# EAGLE design Shruthi-612-v01 (EAGLE 5.09)

## Sheet 1 of 4
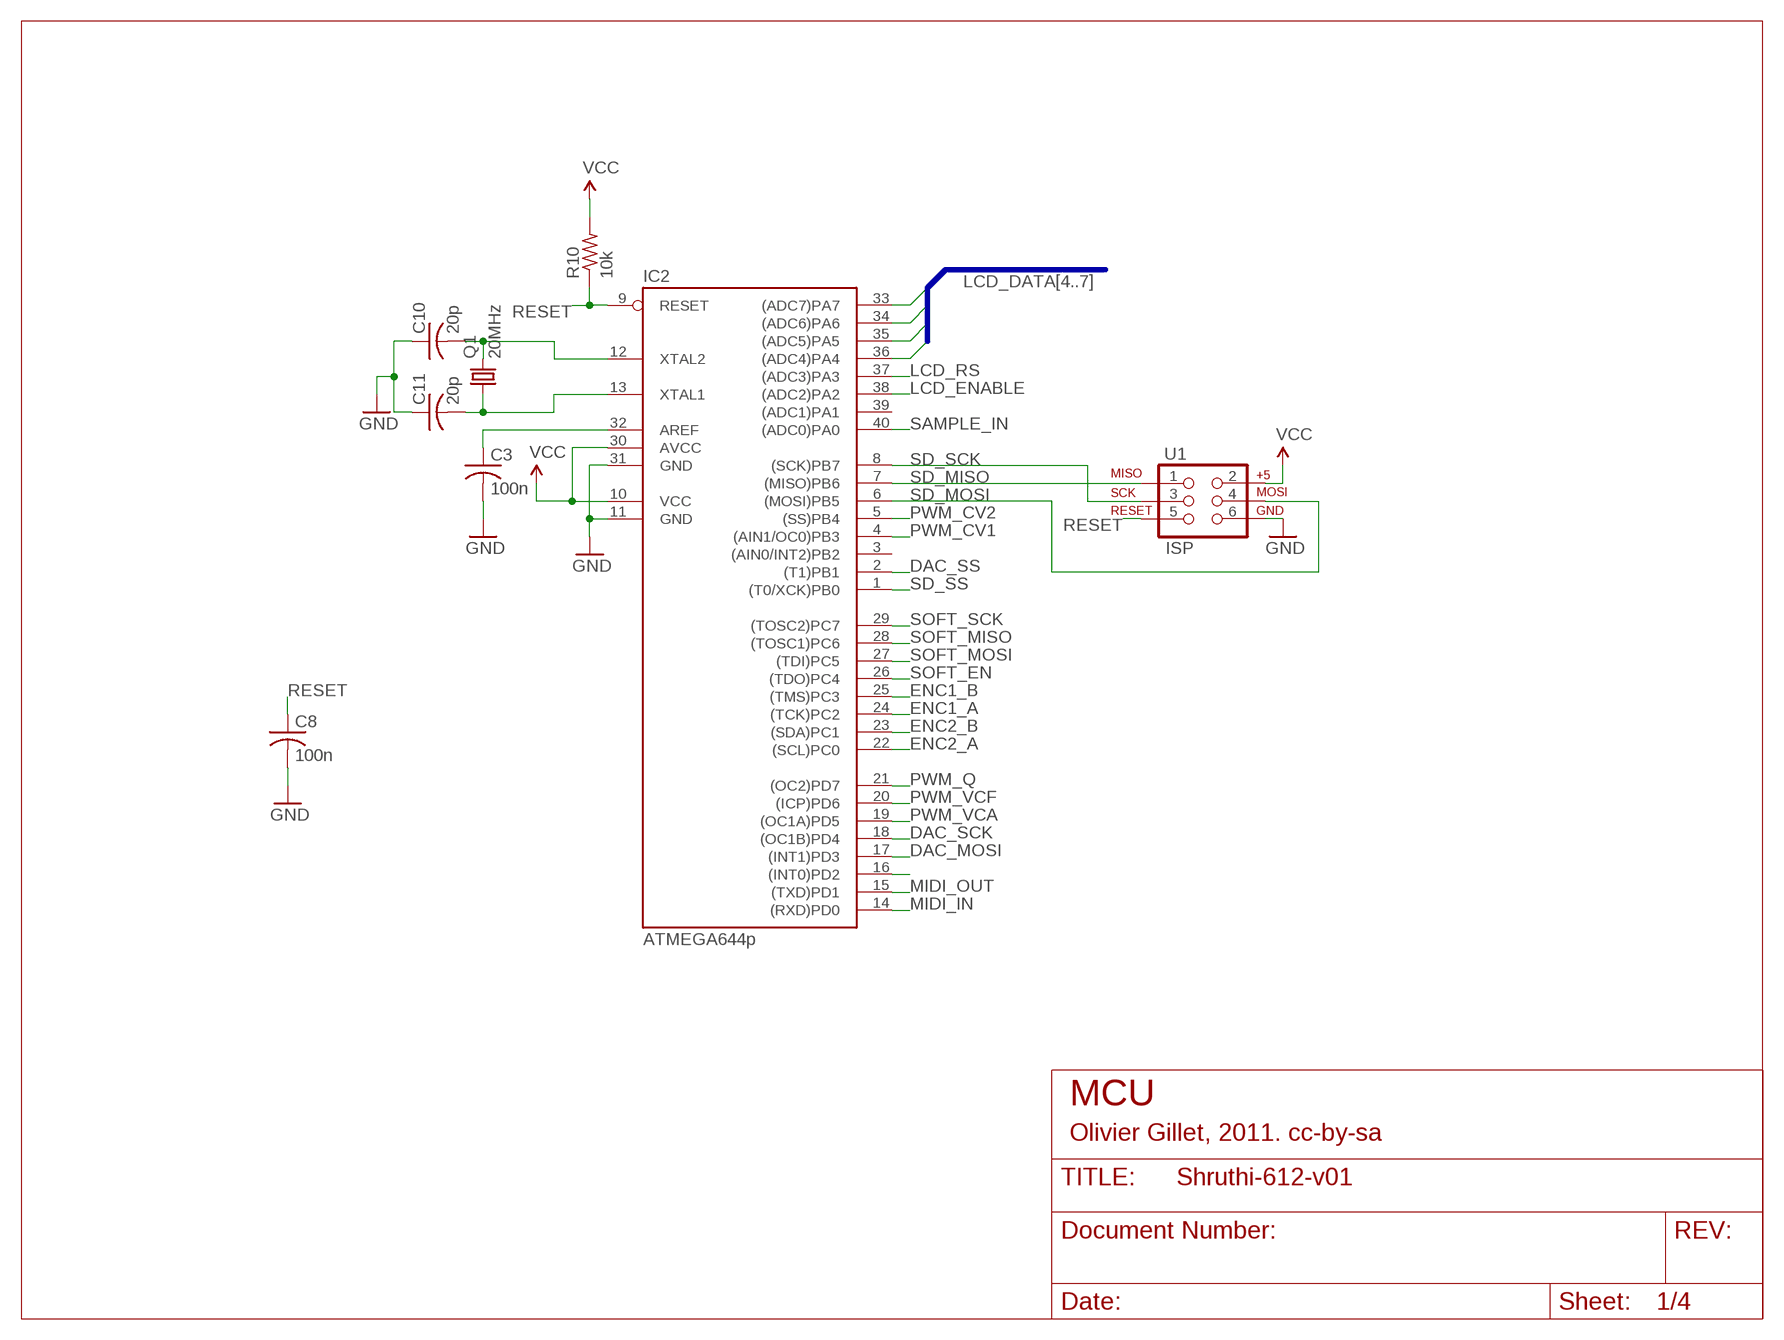
[diagram p0: schematic, sheet 1]

### Parts
C3  100n  C-US025-024X044  [C025-024X044]
C8  100n  C-US025-024X044  [C025-024X044]
C10  20p  C-US025-024X044  [C025-024X044]
C11  20p  C-US025-024X044  [C025-024X044]
IC2  ATMEGA644p  MEGA16-P  [DIL40]
Q1  20MHz  CRYSTALHC49U-V  [HC49U-V]
R10  10k  R-US_0204/7  [0204/7]
U1  ISP  AVR_SPI_PRG_6PTH  [2X3]

### Nets
DAC_MOSI: IC2.17((INT1)PD3) ; also sheet 3
DAC_SCK: IC2.18((OC1B)PD4) ; also sheet 3
DAC_SS: IC2.2((T1)PB1) ; also sheet 3
ENC1_A: IC2.24((TCK)PC2) ; also sheet 2
ENC1_B: IC2.25((TMS)PC3) ; also sheet 2
ENC2_A: IC2.22((SCL)PC0) ; also sheet 2
ENC2_B: IC2.23((SDA)PC1) ; also sheet 2
GND: C3.2 C8.2 C10.1 C11.1 IC2.11(GND) IC2.31(GND) U1.6 ; also sheet 2,3,4
LCD_DATA4: IC2.36((ADC4)PA4) ; also sheet 2
LCD_DATA5: IC2.35((ADC5)PA5) ; also sheet 2
LCD_DATA6: IC2.34((ADC6)PA6) ; also sheet 2
LCD_DATA7: IC2.33((ADC7)PA7) ; also sheet 2
LCD_ENABLE: IC2.38((ADC2)PA2) ; also sheet 2
LCD_RS: IC2.37((ADC3)PA3) ; also sheet 2
MIDI_IN: IC2.14((RXD)PD0) ; also sheet 3
MIDI_OUT: IC2.15((TXD)PD1) ; also sheet 3
N$7: C3.1 IC2.32(AREF)
N$14: IC2.16((INT0)PD2)
N$82: C11.2 IC2.13(XTAL1) Q1.1
N$83: C10.2 IC2.12(XTAL2) Q1.2
PWM_CV1: IC2.4((AIN1/OC0)PB3) ; also sheet 3
PWM_CV2: IC2.5((SS)PB4) ; also sheet 3
PWM_Q: IC2.21((OC2)PD7) ; also sheet 3
PWM_VCA: IC2.19((OC1A)PD5) ; also sheet 3
PWM_VCF: IC2.20((ICP)PD6) ; also sheet 3
RESET: C8.1 IC2.9(RESET) R10.1 U1.5
SAMPLE_IN: IC2.40((ADC0)PA0) ; also sheet 3
SD_MISO: IC2.7((MISO)PB6) U1.1 ; also sheet 3
SD_MOSI: IC2.6((MOSI)PB5) U1.4 ; also sheet 3
SD_SCK: IC2.8((SCK)PB7) U1.3 ; also sheet 3
SD_SS: IC2.1((T0/XCK)PB0) ; also sheet 3
SOFT_EN: IC2.26((TDO)PC4) ; also sheet 2
SOFT_MISO: IC2.28((TOSC1)PC6) ; also sheet 2
SOFT_MOSI: IC2.27((TDI)PC5) ; also sheet 2
SOFT_SCK: IC2.29((TOSC2)PC7) ; also sheet 2
VCC: IC2.10(VCC) IC2.30(AVCC) R10.2 U1.2 ; also sheet 2,3,4
Unconnected: IC2.3((AIN0/INT2)PB2) IC2.39((ADC1)PA1)

### Buses
LCD_DATA[4..7]

### Notes on the sheet
- MCU
- Olivier Gillet, 2011. cc-by-sa

## Sheet 2 of 4
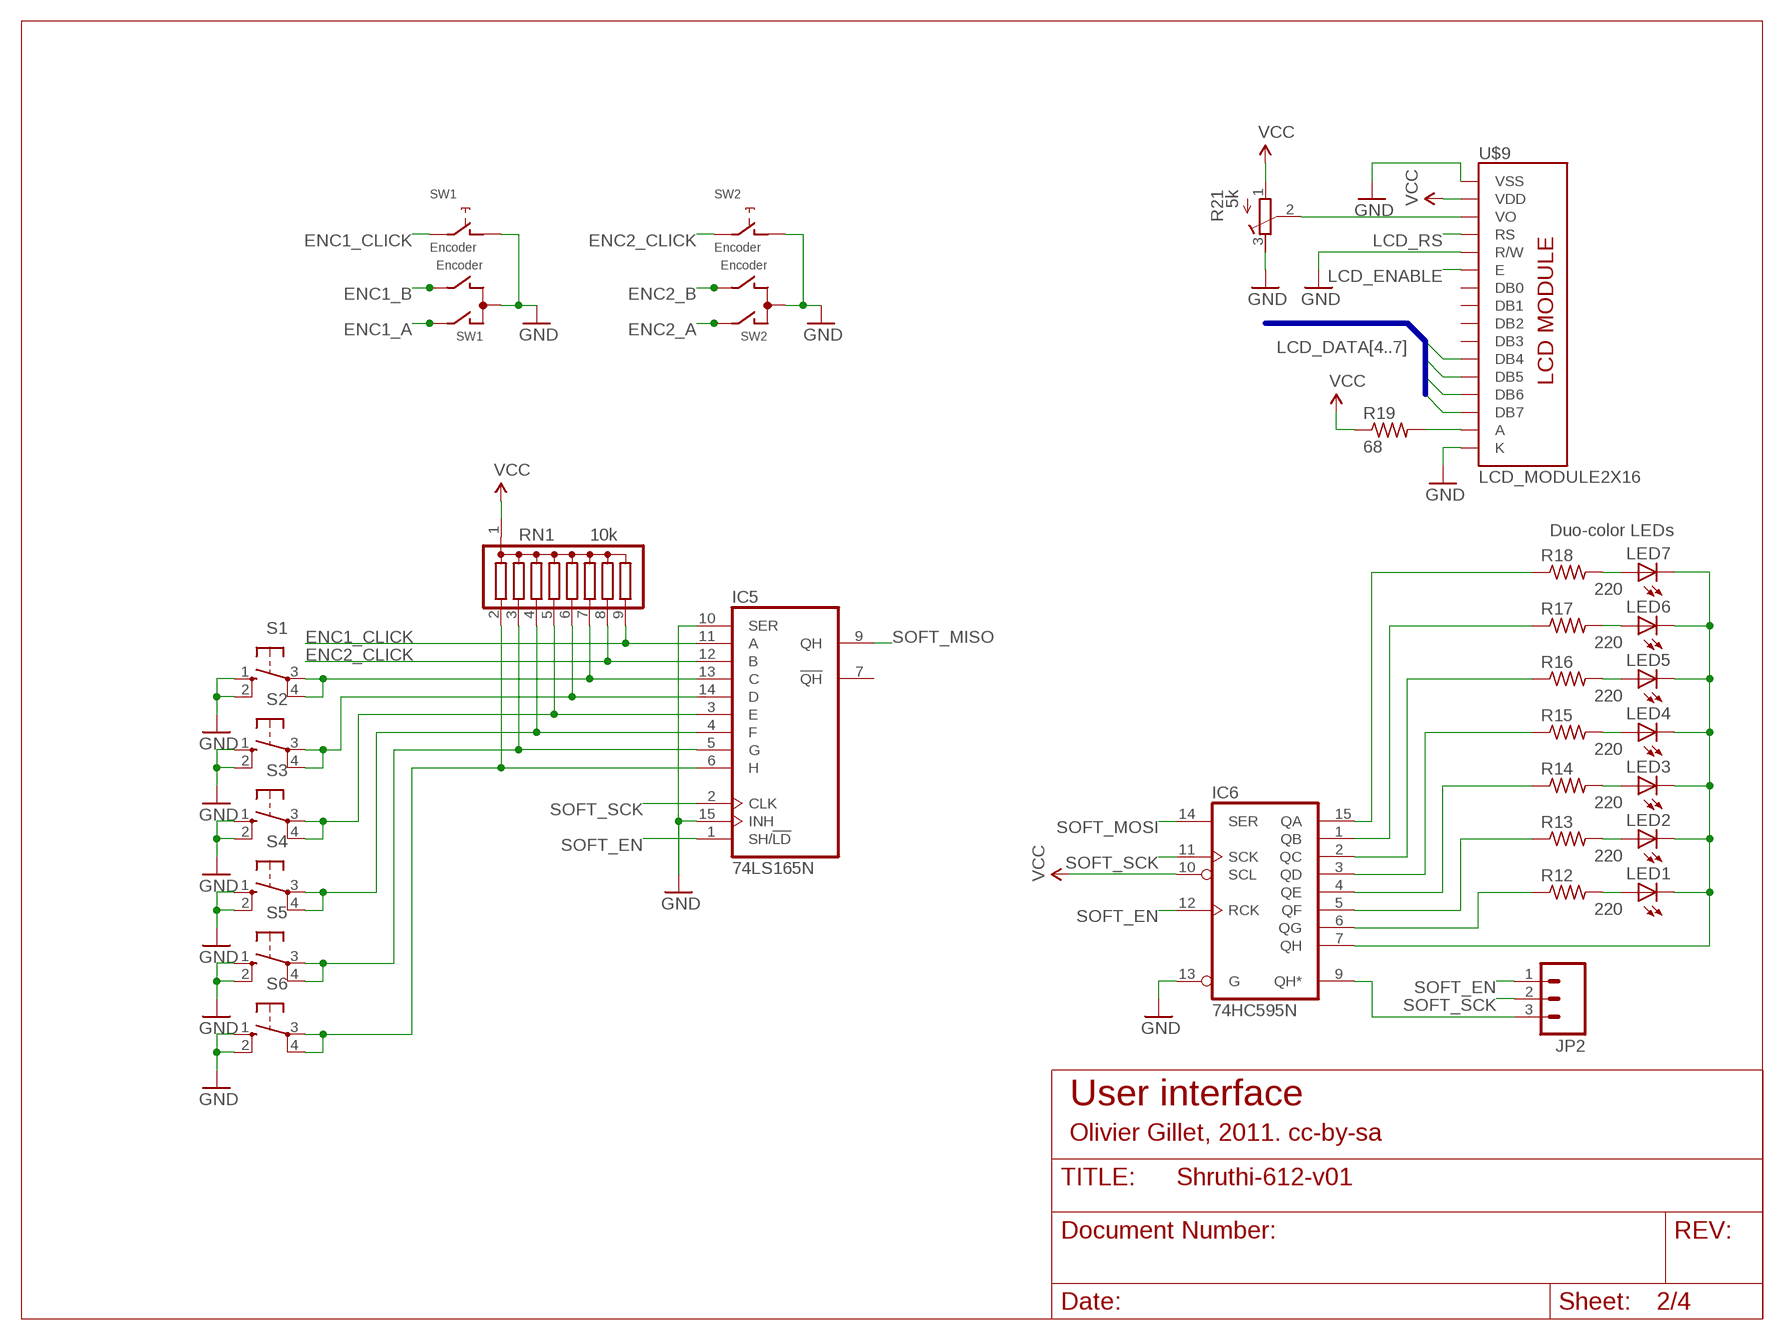
[diagram p1: schematic, sheet 2]

### Parts
IC5  74LS165N  [DIL16]
IC6  74HC595N  [DIL16]
JP2  M03PTH  [1X03]
LED1  LED3MM  [LED3MM]
LED2  LED3MM  [LED3MM]
LED3  LED3MM  [LED3MM]
LED4  LED3MM  [LED3MM]
LED5  LED3MM  [LED3MM]
LED6  LED3MM  [LED3MM]
LED7  LED3MM  [LED3MM]
R12  220  R-US_0204/7  [0204/7]
R13  220  R-US_0204/7  [0204/7]
R14  220  R-US_0204/7  [0204/7]
R15  220  R-US_0204/7  [0204/7]
R16  220  R-US_0204/7  [0204/7]
R17  220  R-US_0204/7  [0204/7]
R18  220  R-US_0204/7  [0204/7]
R19  68  R-US_0204/7  [0204/7]
R21  5k  R-TRIMM3296P  [RTRIM3296P]
RN1  10k  G08R  [SIL9]
S1  40-XX  [B3F-40XX]
S2  40-XX  [B3F-40XX]
S3  40-XX  [B3F-40XX]
S4  40-XX  [B3F-40XX]
S5  40-XX  [B3F-40XX]
S6  40-XX  [B3F-40XX]
SW1  Encoder  EC12E_SW  [ALPS_EC12E_SW]
SW2  Encoder  EC12E_SW  [ALPS_EC12E_SW]
U$9  LCD_MODULE2X16  [LCD_MODULE_2X16]

### Nets
ENC1_A: SW1.A ; also sheet 1
ENC1_B: SW1.B ; also sheet 1
ENC1_CLICK: IC5.11(A) RN1.9 SW1.E
ENC2_A: SW2.A ; also sheet 1
ENC2_B: SW2.B ; also sheet 1
ENC2_CLICK: IC5.12(B) RN1.8 SW2.E
GND: IC5.10(SER) IC5.15(INH) IC6.13(G) R21.3(A) S1.1(S) S1.2(S1) S2.1(S) S2.2(S1) S3.1(S) S3.2(S1) S4.1(S) S4.2(S1) S5.1(S) S5.2(S1) S6.1(S) S6.2(S1) SW1.C SW1.D SW2.C SW2.D U$9.1(VSS) U$9.5(R/W) U$9.16(K) ; also sheet 1,3,4
LCD_DATA4: U$9.11(DB4) ; also sheet 1
LCD_DATA5: U$9.12(DB5) ; also sheet 1
LCD_DATA6: U$9.13(DB6) ; also sheet 1
LCD_DATA7: U$9.14(DB7) ; also sheet 1
LCD_ENABLE: U$9.6(E) ; also sheet 1
LCD_RS: U$9.4(RS) ; also sheet 1
N$1: IC6.2(QC) R16.1
N$2: IC5.5(G) RN1.3 S5.3(P) S5.4(P1)
N$3: IC6.9(QH*) JP2.3
N$6: IC5.13(C) RN1.7 S1.3(P) S1.4(P1)
N$10: IC5.6(H) RN1.2 S6.3(P) S6.4(P1)
N$12: IC5.4(F) RN1.4 S4.3(P) S4.4(P1)
N$16: IC5.14(D) RN1.6 S2.3(P) S2.4(P1)
N$18: R21.2(S) U$9.3(VO)
N$30: IC6.15(QA) R18.1
N$31: IC6.1(QB) R17.1
N$33: IC6.3(QD) R15.1
N$34: IC6.4(QE) R14.1
N$35: IC6.5(QF) R13.1
N$36: IC6.7(QH) LED1.K(C) LED2.K(C) LED3.K(C) LED4.K(C) LED5.K(C) LED6.K(C) LED7.K(C)
N$37: IC6.6(QG) R12.1
N$42: LED7.A R18.2
N$43: LED6.A R17.2
N$44: LED5.A R16.2
N$45: LED4.A R15.2
N$46: LED3.A R14.2
N$47: LED2.A R13.2
N$48: LED1.A R12.2
N$79: R19.2 U$9.15(A)
N$90: IC5.3(E) RN1.5 S3.3(P) S3.4(P1)
SOFT_EN: IC5.1(SH/!LD) IC6.12(RCK) JP2.1 ; also sheet 1
SOFT_MISO: IC5.9(QH) ; also sheet 1
SOFT_MOSI: IC6.14(SER) ; also sheet 1
SOFT_SCK: IC5.2(CLK) IC6.11(SCK) JP2.2 ; also sheet 1
VCC: IC6.10(SCL) R19.1 R21.1(E) RN1.1 U$9.2(VDD) ; also sheet 1,3,4
Unconnected: IC5.7(!QH) SW1.GND1(G) SW1.GND2(G) SW2.GND1(G) SW2.GND2(G) U$9.7(DB0) U$9.8(DB1) U$9.9(DB2) U$9.10(DB3)

### Buses
LCD_DATA[4..7]

### Notes on the sheet
- Duo-color LEDs
- User interface
- Olivier Gillet, 2011. cc-by-sa

## Sheet 3 of 4
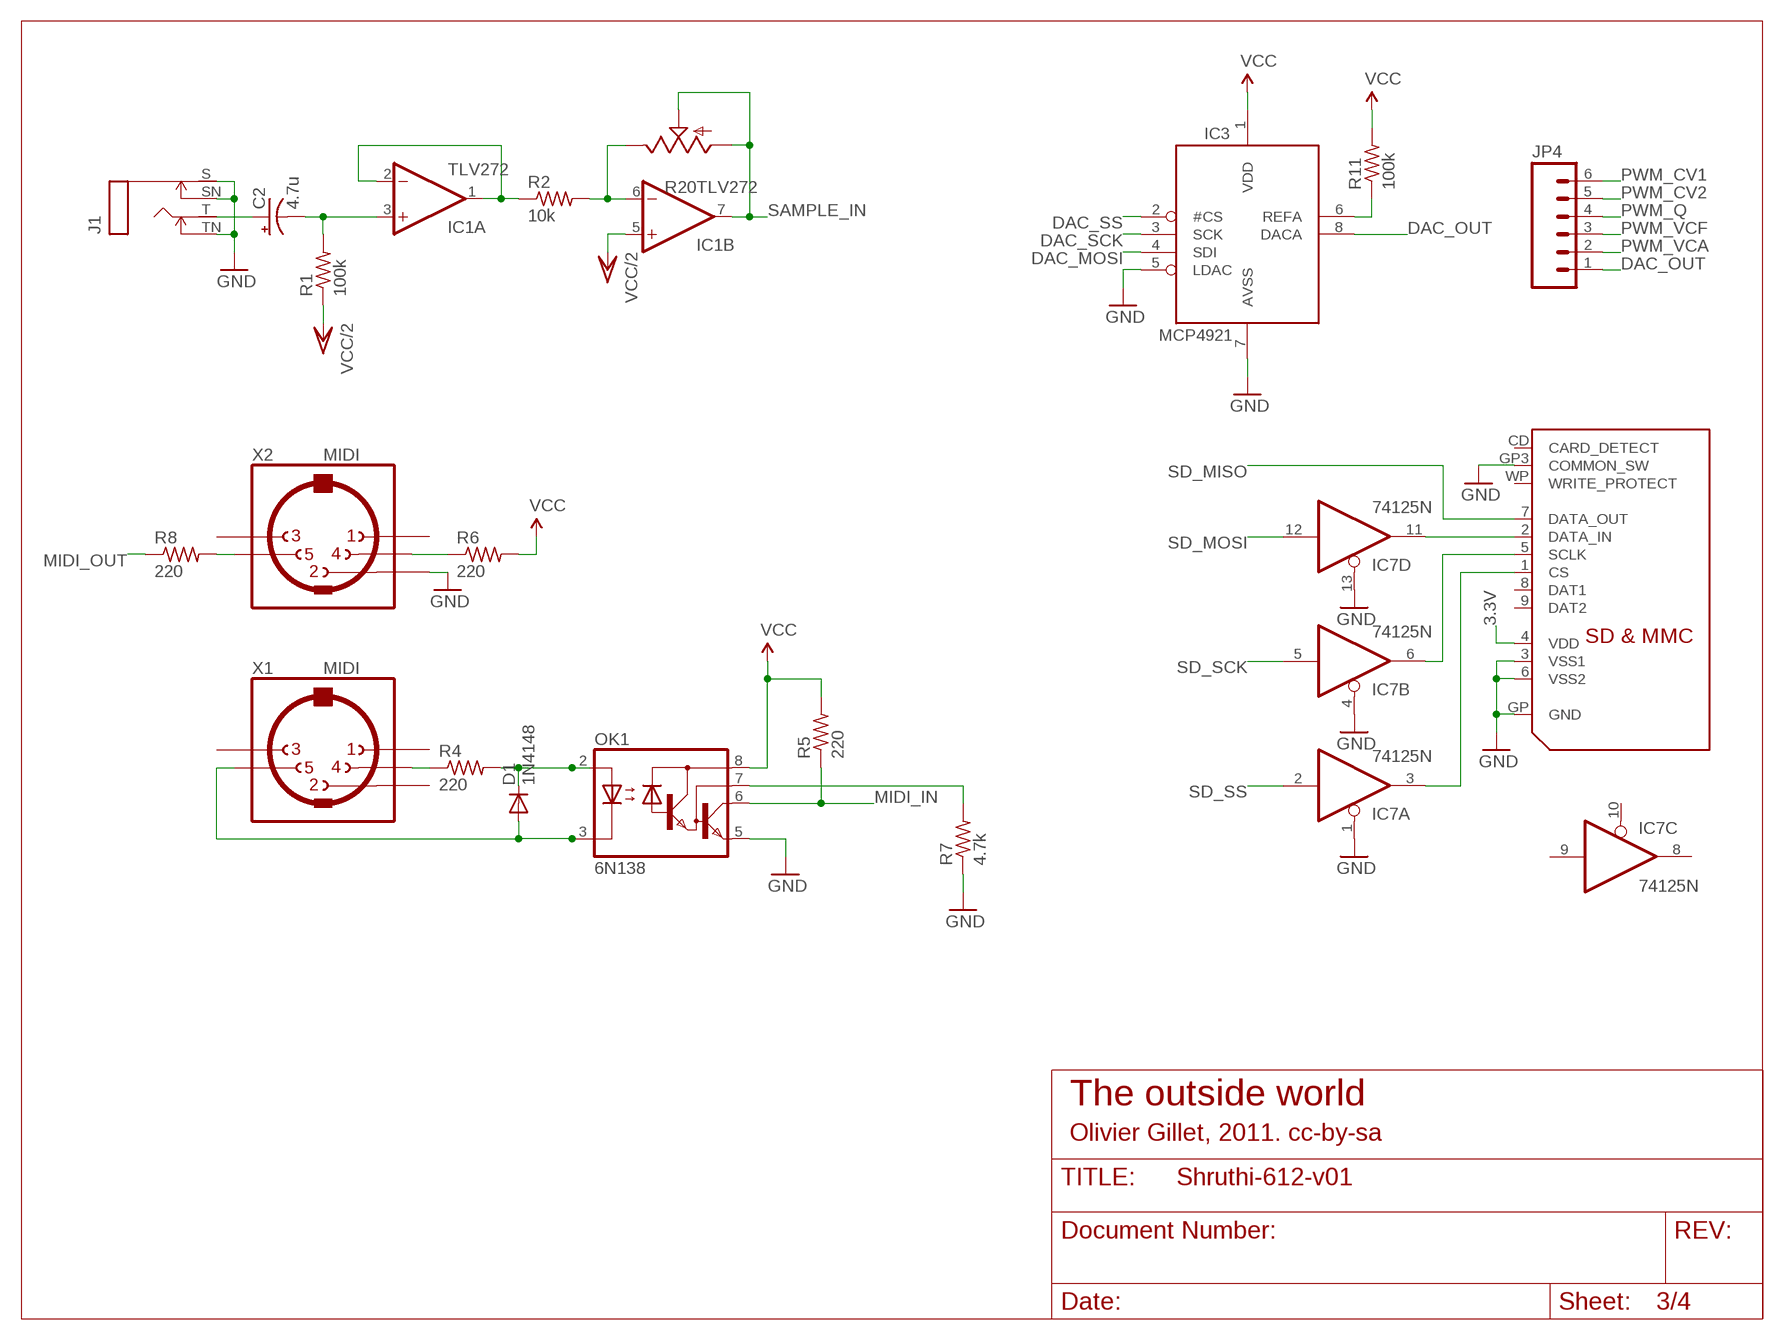
[diagram p2: schematic, sheet 3]

### Parts
C2  4.7u  CPOL-USE2.5-7  [E2,5-7]
D1  1N4148  DIODE-D-5  [D-5]
IC1  TLV272  TL072P  [DIL08]
IC3  MCP4921  [DIL08]
IC7  74125N  [DIL14]
J1  MONOSWS  [NMJ4HC-S]
JP4  M06SIP  [1X06]
OK1  6N138  [DIL08]
R1  100k  R-US_0204/7  [0204/7]
R2  10k  R-US_0204/7  [0204/7]
R4  220  R-US_0204/7  [0204/7]
R5  220  R-US_0204/7  [0204/7]
R6  220  R-US_0204/7  [0204/7]
R7  4.7k  R-US_0204/7  [0204/7]
R8  220  R-US_0204/7  [0204/7]
R11  100k  R-US_0204/7  [0204/7]
R20  POT_USVERTICAL  [ALPS_POT_VERTICAL]
U$8  SDMMC06132  [06132]
X1  MIDI  MAB5SH  [MAB5SH]
X2  MIDI  MAB5SH  [MAB5SH]

### Nets
3.3V: U$8.4(VDD) ; also sheet 4
AVSS: IC3.7(AVSS) ; supply symbol labelled GND
DAC_MOSI: IC3.4(SDI) ; also sheet 1
DAC_OUT: IC3.8(DACA) JP4.1
DAC_SCK: IC3.3(SCK) ; also sheet 1
DAC_SS: IC3.2(#CS) ; also sheet 1
GND: IC3.5(LDAC) IC7.1(A:OE) IC7.4(B:OE) IC7.13(D:OE) J1.S J1.SN J1.TN OK1.5(GND) R7.1 U$8.3(VSS1) U$8.6(VSS2) U$8.GP3(COMMON_SW) U$8.GP(GND) X2.2 ; also sheet 1,2,4
MIDI_IN: OK1.6(VO) R5.1 ; also sheet 1
MIDI_OUT: R8.1 ; also sheet 1
N$4: IC1.1(A:OUT) IC1.2(A:-IN) R2.1
N$5: C2.- IC1.3(A:+IN) R1.2
N$8: R8.2 X2.5
N$11: IC3.6(REFA) R11.1
N$13: OK1.7(VB) R7.2
N$15: C2.+ J1.T
N$17: IC1.6(B:-IN) R2.2 R20.P$1(E)
N$25: IC7.11(D:O) U$8.2(DATA_IN)
N$28: D1.C OK1.2(A) R4.2
N$29: IC7.6(B:O) U$8.5(SCLK)
N$52: IC7.3(A:O) U$8.1(CS)
N$68: R6.1 X2.4
N$72: R4.1 X1.4
N$73: D1.A OK1.3(C) X1.5
PWM_CV1: JP4.6 ; also sheet 1
PWM_CV2: JP4.5 ; also sheet 1
PWM_Q: JP4.4 ; also sheet 1
PWM_VCA: JP4.2 ; also sheet 1
PWM_VCF: JP4.3 ; also sheet 1
SAMPLE_IN: IC1.7(B:OUT) R20.P$2(S) R20.P$3(A) ; also sheet 1
SD_MISO: U$8.7(DATA_OUT) ; also sheet 1
SD_MOSI: IC7.12(D:I) ; also sheet 1
SD_SCK: IC7.5(B:I) ; also sheet 1
SD_SS: IC7.2(A:I) ; also sheet 1
VCC: IC3.1(VDD) OK1.8(VCC) R5.2 R6.2 R11.2 ; also sheet 1,2,4
VCC/2: IC1.5(B:+IN) R1.1 ; also sheet 4
Unconnected: IC7.8(C:O) IC7.9(C:I) IC7.10(C:OE) U$8.8(DAT1) U$8.9(DAT2) U$8.CD(CARD_DETECT) U$8.WP(WRITE_PROTECT) X1.1 X1.2 X1.3 X2.1 X2.3

### Notes on the sheet
- The outside world
- Olivier Gillet, 2011. cc-by-sa

## Sheet 4 of 4
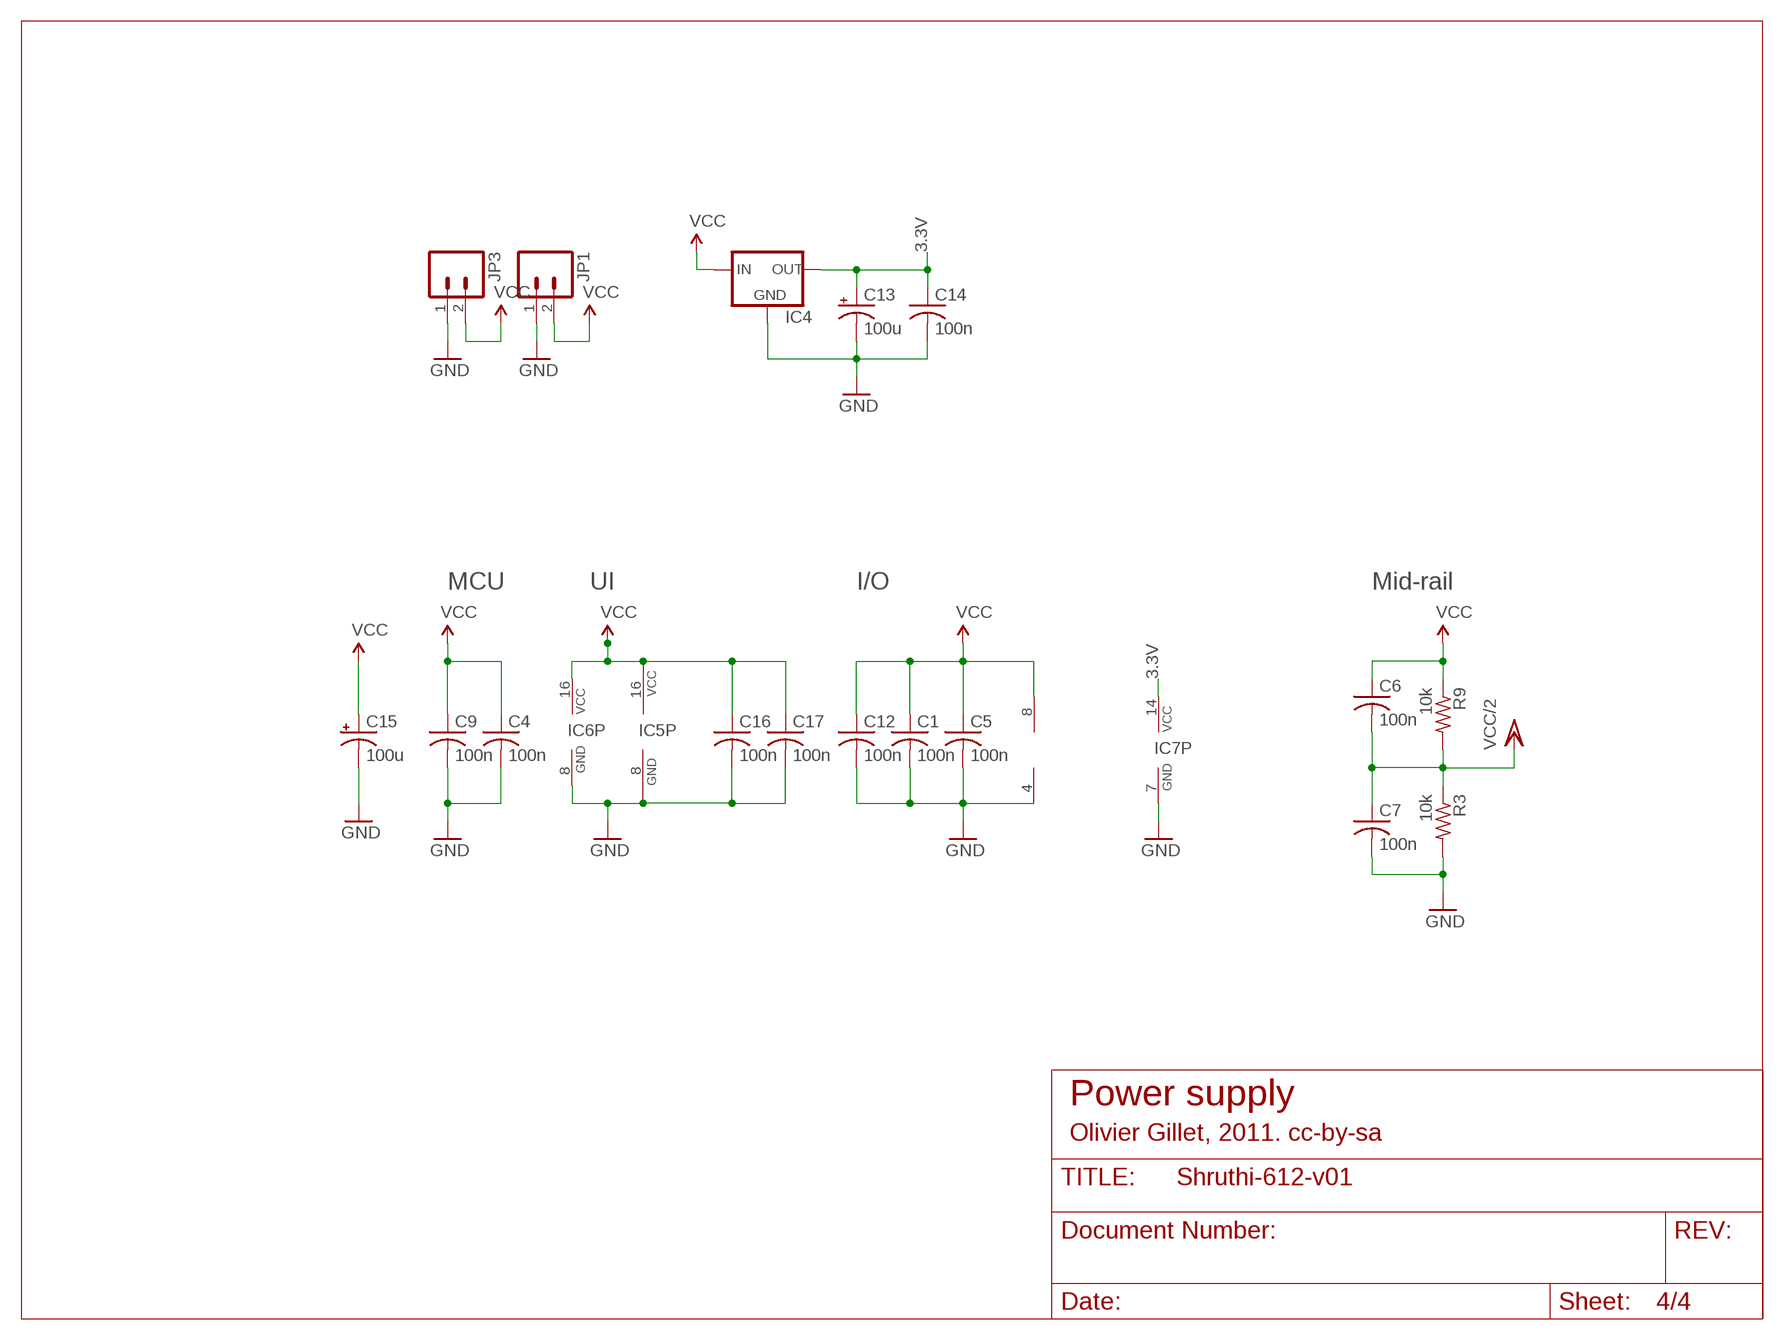
[diagram p3: schematic, sheet 4]

### Parts
C1  100n  C-US025-024X044  [C025-024X044]
C4  100n  C-US025-024X044  [C025-024X044]
C5  100n  C-US025-024X044  [C025-024X044]
C6  100n  C-US025-024X044  [C025-024X044]
C7  100n  C-US025-024X044  [C025-024X044]
C9  100n  C-US025-024X044  [C025-024X044]
C12  100n  C-US025-024X044  [C025-024X044]
C13  100u  CPOL-USE2.5-7  [E2,5-7]
C14  100n  C-US025-024X044  [C025-024X044]
C15  100u  CPOL-USE2.5-7  [E2,5-7]
C16  100n  C-US025-024X044  [C025-024X044]
C17  100n  C-US025-024X044  [C025-024X044]
IC4  MCP1700INLINE  [TO92-INLINE]
JP1  M02PTH  [1X02]
JP3  M02PTH  [1X02]
R3  10k  R-US_0204/7  [0204/7]
R9  10k  R-US_0204/7  [0204/7]

### Nets
3.3V: C13.+ C14.1 IC4.3(OUT) IC7.14(P:VCC) ; also sheet 3
GND: C1.2 C4.2 C5.2 C7.2 C9.2 C12.2 C13.- C14.2 C15.- C16.2 C17.2 IC1.4(P:V-) IC4.1(GND) IC5.8(GND) IC6.8(GND) IC7.7(P:GND) JP1.1 JP3.1 R3.2 ; also sheet 1,2,3
VCC: C1.1 C4.1 C5.1 C6.1 C9.1 C12.1 C15.+ C16.1 C17.1 IC1.8(P:V+) IC4.2(IN) IC5.16(VCC) IC6.16(VCC) JP1.2 JP3.2 R9.1 ; also sheet 1,2,3
VCC/2: C6.2 C7.1 R3.1 R9.2 ; also sheet 3

### Notes on the sheet
- MCU | UI | I/O | Mid-rail
- Power supply
- Olivier Gillet, 2011. cc-by-sa

## Library data of the parts
C1 C3-C12 C14 C16 C17 = rcl:C-US: CAPACITOR, American symbol
C2 C13 C15 = rcl:CPOL-US: POLARIZED CAPACITOR, American symbol
D1 = diode:DIODE-: DIODE
IC1 = gm-ics:TL072: OP AMP
IC2 = atmel:MEGA16-P: MICROCONTROLLER 16 Kbytes FLASH 1 kbytes SRAM 512 bytes EEPROM USART 8-channel 10 bit ADC Source: avr.lbr
IC3 = adafruit:MCP4921
IC4 = adafruit:MCP1700: VOLTAGE REGULATOR
IC5 = 74xx-us:74*165: 8-bit parallel load SHIFT REGISTER
IC6 = 74xx-eu:74*595: 8-bit SHIFT REGISTER, output latch
IC7 = 74xx-eu:74*125: Quad bus BUFFER, 3-state
J1 = og-neutrik:MONOSW
JP1 JP3 = SparkFun:M02: Header 2 Standard 2-pin 0.1" header. Use with straight break away headers (SKU : PRT-00116), right angle break away headers (PRT-00553), swiss pins (PRT-00743), machine pins (PRT-00117), and female headers (PRT-00115). Molex polarized connector foot print use with SKU : PRT-08233 with associated crimp pins and housings.
JP2 = SparkFun:M03: Header 3 Standard 3-pin 0.1" header. Use with straight break away headers (SKU : PRT-00116), right angle break away headers (PRT-00553), swiss pins (PRT-00743), machine pins (PRT-00117), and female headers (PRT-00115). Molex polarized connector foot print use with SKU : PRT-08232 with associated crimp pins and housings.
JP4 = SparkFun:M06: Header 6 Standard 6-pin 0.1" header. Use with straight break away headers (SKU : PRT-00116), right angle break away headers (PRT-00553), swiss pins (PRT-00743), machine pins (PRT-00117), and female headers (PRT-00115). Molex polarized connector foot print use with SKU : PRT-08094 with associated crimp pins and housings. NOTES ON THE VARIANTS LOCK and LOCK_LONGPADS... This footprint was designed to help hold the alignment of a through-hole component (i.e. 6-pin header) while soldering it into place. You may notice that each hole has been shifted either up or down by 0.005 of an inch from it's more standard position (which is a perfectly straight line). This slight alteration caused the pins (the squares in the middle) to touch the edges of the holes. Because they are alternating, it causes a "brace" to hold the component in place. 0.005 has proven to be the perfect amount of "off-center" position when using our standard breakaway headers. Although looks a little odd when you look at the bare footprint, once you have a header in there, the alteration is very hard to notice. Also, if you push a header all the way into place, it is covered up entirely on the bottom side. This idea of altering the position of holes to aid alignment will be further integrated into the Sparkfun Library for other footprints. It can help hold any component with 3 or more connection pins.
LED1-LED7 = led:LED: LED OSRAM: - CHIPLED LG R971, LG N971, LY N971, LG Q971, LY Q971, LO R971, LY R971 LH N974, LH R974 LS Q976, LO Q976, LY Q976 LO Q996 - Hyper CHIPLED LW Q18S LB Q993, LB Q99A, LB R99A - SideLED LS A670, LO A670, LY A670, LG A670, LP A670 LB A673, LV A673, LT A673, LW A673 LH A674 LY A675 LS A676, LA A676, LO A676, LY A676, LW A676 LS A679, LY A679, LG A679 - Hyper Micro SIDELED® LS Y876, LA Y876, LO Y876, LY Y876 LT Y87S - SmartLED LW L88C, LW L88S LB L89C, LB L89S, LG L890 LS L89K, LO L89K, LY L89K LS L896, LA L896, LO L896, LY L896 - TOPLED LS T670, LO T670, LY T670, LG T670, LP T670 LSG T670, LSP T670, LSY T670, LOP T670, LYG T670 LG T671, LOG T671, LSG T671 LB T673, LV T673, LT T673, LW T673 LH T674 LS T676, LA T676, LO T676, LY T676, LB T676, LH T676, LSB T676, LW T676 LB T67C, LV T67C, LT T67C, LS T67K, LO T67K, LY T67K, LW E67C LS E67B, LA E67B, LO E67B, LY E67B, LB E67C, LV E67C, LT E67C LW T67C LS T679, LY T679, LG T679 LS T770, LO T770, LY T770, LG T770, LP T770 LB T773, LV T773, LT T773, LW T773 LH T774 LS E675, LA E675, LY E675, LS T675 LS T776, LA T776, LO T776, LY T776, LB T776 LHGB T686 LT T68C, LB T68C - Hyper Mini TOPLED® LB M676 - Mini TOPLED Santana® LG M470 LS M47K, LO M47K, LY M47K Source: http://www.osram.convergy.de LUXEON: - LUMILED® LXK2-PW12-R00, LXK2-PW12-S00, LXK2-PW14-U00, LXK2-PW14-V00 LXK2-PM12-R00, LXK2-PM12-S00, LXK2-PM14-U00 LXK2-PE12-Q00, LXK2-PE12-R00, LXK2-PE12-S00, LXK2-PE14-T00, LXK2-PE14-U00 LXK2-PB12-K00, LXK2-PB12-L00, LXK2-PB12-M00, LXK2-PB14-N00, LXK2-PB14-P00, LXK2-PB14-Q00 LXK2-PR12-L00, LXK2-PR12-M00, LXK2-PR14-Q00, LXK2-PR14-R00 LXK2-PD12-Q00, LXK2-PD12-R00, LXK2-PD12-S00 LXK2-PH12-R00, LXK2-PH12-S00 LXK2-PL12-P00, LXK2-PL12-Q00, LXK2-PL12-R00 Source: www.luxeon.com KINGBRIGHT: KA-3528ASYC Source: www.kingbright.com
OK1 = optocoupler:6N138: MOTOROLA OPTO COUPLER
Q1 = crystal:CRYSTAL: CRYSTAL
R1-R19 = rcl:R-US_: RESISTOR, American symbol
R20 = pot-alps:POT_US
R21 = rcl:R-TRIMM: Trimm resistor
RN1 = resistor-sil:G08R: SIL RESISTOR
S1-S6 = og-switch:40-XX: OMRON SWITCH
SW1 SW2 = switch-alps:EC12E_SW: ALPS rotary Encoder EC12E series with switch
U1 = SparkFun:AVR_SPI_PRG_6: AVR ISP 6 Pin This is the reduced ISP connector for AVR programming. Common on Arduino. This footprint will take up less PCB space and can be used with a 10-pin to 6-pin adapter such as SKU: BOB-08508
U$8 = adafruit:SDMMC: SD MMC Card holder 4UCON part #06132 - easy to solder
U$9 = og-lcd:LCD_MODULE: Character LCD module
X1 X2 = og-midi:MAB5SH: Female CONNECTOR 5 pins 90 deg. with shield, horizontal (DIN 41524)

## Board
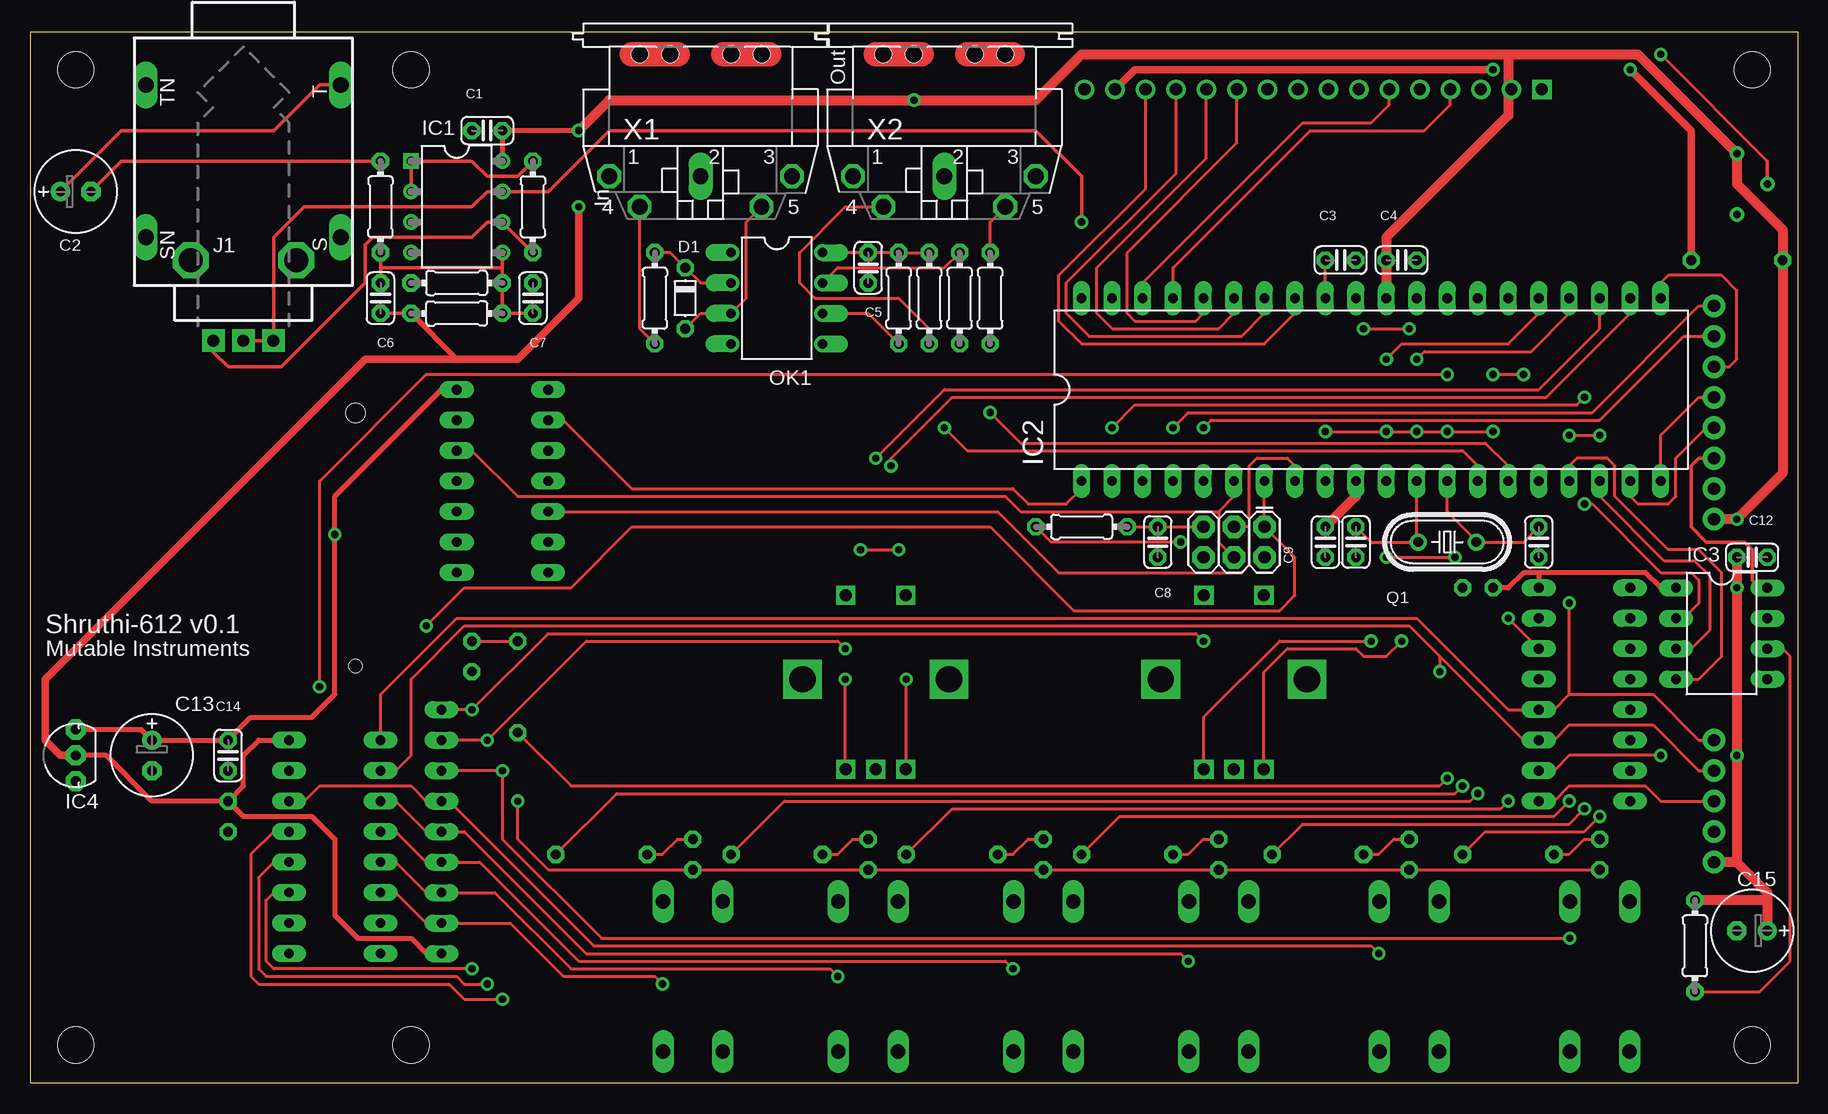
[diagram p4: board, top side]
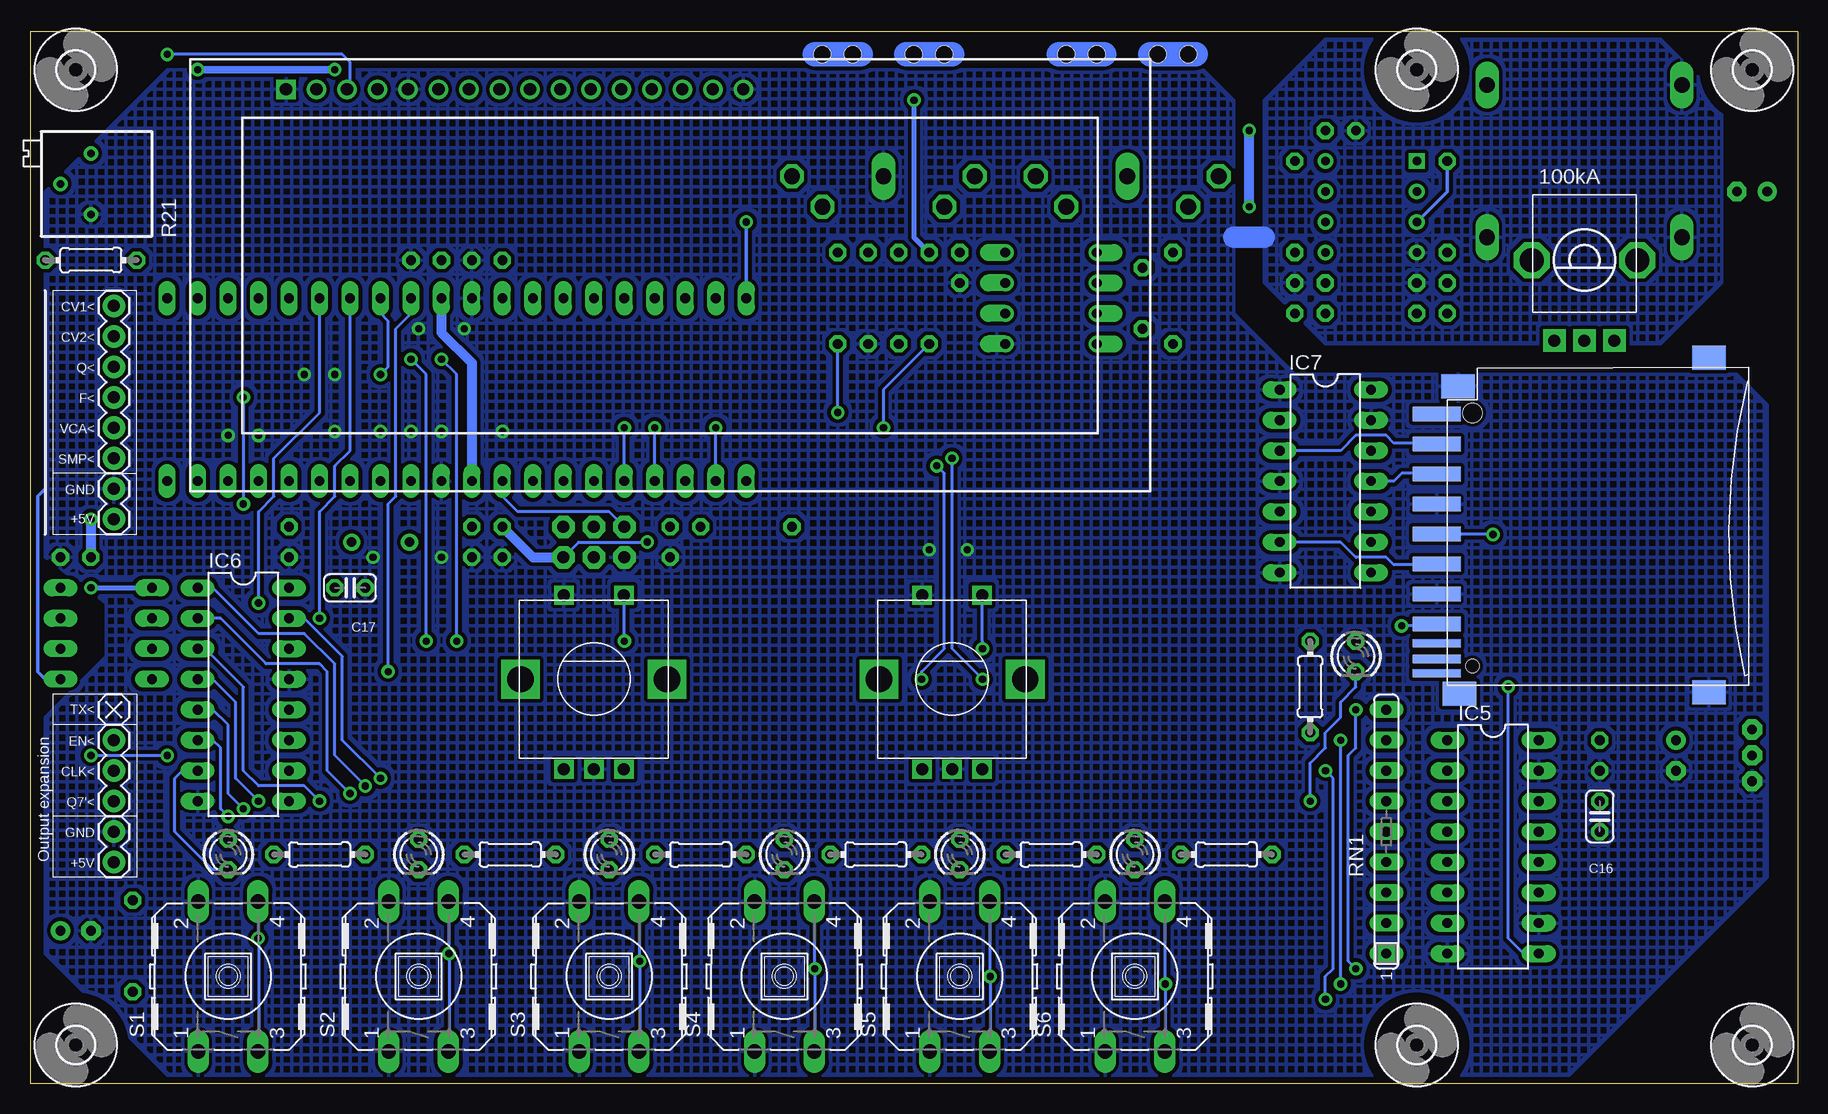
[diagram p5: board, bottom side, seen from below]

Size 147.32 x 87.63 mm. Coordinates in mm from the lower left corner, seen from the top.
Outline: 0,87.63 147.32,87.63 147.32,0 0,0 0,87.63
Copper layers (1*16): Top 0.035mm / dielectric 1.5mm / Bottom 0.035mm
Design rules "SparkFun *": minimum track width 8mil, minimum drill 20mil, track to track 8mil, track to pad 8mil, pad to pad 8mil, via to via 8mil, smd to smd 8mil, copper to edge 10mil, drill to drill 8mil, minimum pad ring 12mil, minimum via ring 10mil, stop-mask expansion 4mil, vias tented up to drill 25mil, thermal gap 10mil

### Footprints (pad centres in the part's own frame; a part is rotated, then mirrored left to right if it is on the bottom)
C025-024X044 = drill 0.813 octagon: 1 -1.27,0; 2 1.27,0
E2,5-7 = drill 0.813 pad 1.6 round: + -1.27,0 | drill 0.813 pad 1.6 octagon: - 1.27,0
D-5 = drill 0.813 octagon: A 2.54,0; C -2.54,0
DIL08 = drill 0.7 square: 1 -3.81,-3.81 | drill 0.7 round: 2 -1.27,-3.81; 3 1.27,-3.81; 4 3.81,-3.81; 5 3.81,3.81; 6 1.27,3.81; 7 -1.27,3.81; 8 -3.81,3.81
DIL40 = drill 0.813 long: 1 -24.13,-7.62; 2 -21.59,-7.62; 3 -19.05,-7.62; 4 -16.51,-7.62; 5 -13.97,-7.62; 6 -11.43,-7.62; 7 -8.89,-7.62; 8 -6.35,-7.62; 9 -3.81,-7.62; 10 -1.27,-7.62; 11 1.27,-7.62; 12 3.81,-7.62; 13 6.35,-7.62; 14 8.89,-7.62; 15 11.43,-7.62; 16 13.97,-7.62; 17 16.51,-7.62; 18 19.05,-7.62; 19 21.59,-7.62; 20 24.13,-7.62; 21 24.13,7.62; 22 21.59,7.62; 23 19.05,7.62; 24 16.51,7.62; 25 13.97,7.62; 26 11.43,7.62; 27 8.89,7.62; 28 6.35,7.62; 29 3.81,7.62; 30 1.27,7.62; 31 -1.27,7.62; 32 -3.81,7.62; 33 -6.35,7.62; 34 -8.89,7.62; 35 -11.43,7.62; 36 -13.97,7.62; 37 -16.51,7.62; 38 -19.05,7.62; 39 -21.59,7.62; 40 -24.13,7.62
DIL08' = drill 0.813 long: 1 -3.81,-3.81; 2 -1.27,-3.81; 3 1.27,-3.81; 4 3.81,-3.81; 5 3.81,3.81; 6 1.27,3.81; 7 -1.27,3.81; 8 -3.81,3.81
TO92-INLINE = drill 0.813 pad 1.676 octagon: 1 -2.159,0; 2 0,0; 3 2.159,0
DIL16 = drill 0.813 long: 1 -8.89,-3.81; 2 -6.35,-3.81; 3 -3.81,-3.81; 4 -1.27,-3.81; 5 1.27,-3.81; 6 3.81,-3.81; 7 6.35,-3.81; 8 8.89,-3.81; 9 8.89,3.81; 10 6.35,3.81; 11 3.81,3.81; 12 1.27,3.81; 13 -1.27,3.81; 14 -3.81,3.81; 15 -6.35,3.81; 16 -8.89,3.81
DIL14 = drill 0.813 long: 1 -7.62,-3.81; 2 -5.08,-3.81; 3 -2.54,-3.81; 4 0,-3.81; 5 2.54,-3.81; 6 5.08,-3.81; 7 7.62,-3.81; 8 7.62,3.81; 9 5.08,3.81; 10 2.54,3.81; 11 0,3.81; 12 -2.54,3.81; 13 -5.08,3.81; 14 -7.62,3.81
NMJ4HC-S = drill 1.3 long: S 5.08,8.115; SN 5.08,-8.115; T -7.62,8.115; TN -7.62,-8.115
1X02 = drill 1.016 pad 1.88 round: 1 0,0; 2 2.54,0
1X03 = drill 1.016 pad 1.88 round: 1 0,0; 2 2.54,0; 3 5.08,0
1X06 = drill 1.016 pad 1.88 round: 1 0,0; 2 2.54,0; 3 5.08,0; 4 7.62,0; 5 10.16,0; 6 12.7,0
LED3MM = drill 0.813 octagon: A -1.27,0; K 1.27,0
DIL08'' = drill 0.813 offset: 1 -3.81,-3.81; 2 -1.27,-3.81; 3 1.27,-3.81; 4 3.81,-3.81; 5 3.81,3.81; 6 1.27,3.81; 7 -1.27,3.81; 8 -3.81,3.81
HC49U-V = drill 0.813 round: 1 -2.413,0; 2 2.413,0
0204/7 = drill 0.813 octagon: 1 -3.81,0; 2 3.81,0
ALPS_POT_VERTICAL = drill 1 pad 1.88 square: P$1 -2.5,6.7; P$2 0,6.7; P$3 2.5,6.7 | drill 2 octagon: P$4 -4.4,0; P$5 4.4,0
RTRIM3296P = drill 0.61 round: 1 0,-2.54; 2 2.54,0; 3 0,2.54
SIL9 = drill 0.813 long: 1 -10.16,0; 2 -7.62,0; 3 -5.08,0; 4 -2.54,0; 5 0,0; 6 2.54,0; 7 5.08,0; 8 7.62,0; 9 10.16,0
B3F-40XX = drill 1.194 long: 1 -6.248,2.489; 2 6.248,2.489; 3 -6.248,-2.489; 4 6.248,-2.489
ALPS_EC12E_SW = drill 1 square: A -2.5,-7.5; B 2.5,-7.5; C 0,-7.5; D -2.5,7; E 2.5,7 | drill 2.2 square: GND1 -6.1,0; GND2 6.1,0
2X3 = drill 1.016 pad 1.88 octagon: 1 0,0; 2 0,2.54; 3 2.54,0; 4 2.54,2.54; 5 5.08,0; 6 5.08,2.54
3,0 = hole 3: 0,0
06132 = smd 1.2 x 4: 1 6.9,0.9; 2 4.4,0.9; 3 1.9,0.9; 4 -0.6,0.9; 5 -3.1,0.9; 6 -5.6,0.9; 7 -8.1,0.9; 9 9.4,0.9 | smd 0.7 x 4: 8 -9.7,0.9; CD -11,0.9; WP -12.2,0.9 | smd 2 x 2.8: GP -13.8,-21.8; GP2 14.1,-21.8; GP3 11.7,-0.9; GP4 -13.9,-1 | hole 1.1: -11.6,-2.1 | hole 1.6: 9.5,-2.1
LCD_MODULE_2X16 = drill 1.016 square: 1 -29.46,14.23 | drill 1.016 round: 2 -26.92,14.23; 3 -24.38,14.23; 4 -21.84,14.23; 5 -19.3,14.23; 6 -16.76,14.23; 7 -14.22,14.23; 8 -11.68,14.23; 9 -9.14,14.23; 10 -6.6,14.23; 11 -4.06,14.23; 12 -1.52,14.23; 13 1.02,14.23; 14 3.56,14.23; 15 6.1,14.23; 16 8.64,14.23
MAB5SH = drill 1.321 octagon: 1 7.62,7.62; 3 -7.62,7.62; 4 5.08,10.16; 5 -5.08,10.16 | drill 1.321 long: 2 0,7.62 | hole 1.4: 2.54,-2.54; -2.54,-2.54; -5.08,-2.54; 5.08,-2.54

### Placement (x,y rotation side)
C1  38.1,79.38 180 top
C2  3.81,74.3 0 top
C3  109.22,68.58 0 top
C4  114.3,68.58 0 top
C5  69.85,67.94 270 top
C6  29.21,65.41 90 top
C7  41.91,65.41 90 top
C8  93.98,45.08 270 top
C9  107.95,45.08 270 top
C10  110.49,45.08 90 top
C11  125.73,45.08 90 top
C12  143.51,43.81 0 top
C13  10.16,27.3 270 top
C14  16.51,27.3 270 top
C15  143.51,12.7 180 top
C16  16.51,22.23 270 bottom
C17  120.65,41.27 0 bottom
D1  54.61,65.41 270 top
IC1  35.56,73.02 270 top
IC2  111.76,57.78 0 top
IC3  MCP4921  [DIL08']  140.97,37.46 270 top
IC4  3.81,27.3 90 top
IC5  25.4,19.69 270 bottom
IC6  129.54,32.38 270 bottom
IC7  39.37,50.16 270 bottom
J1  17.78,75.56 270 top
JP1  140.34,20.96 270 bottom
JP2  140.34,28.57 270 bottom
JP3  140.34,49.53 270 bottom
JP4  140.34,52.07 90 bottom
LED1  130.81,19.05 270 bottom
LED2  114.94,19.05 270 bottom
LED3  99.06,19.05 270 bottom
LED4  84.45,19.05 270 bottom
LED5  69.85,19.05 270 bottom
LED6  55.24,19.05 270 bottom
LED7  36.83,35.56 270 bottom
OK1  6N138  [DIL08'']  62.23,65.41 270 top
Q1  118.11,45.08 180 top
R1  29.21,73.02 90 top
R2  41.91,73.02 270 top
R3  35.56,66.67 180 top
R4  52.07,65.41 90 top
R5  72.39,65.41 90 top
R6  74.93,65.41 90 top
R7  77.47,65.41 90 top
R8  80.01,65.41 90 top
R9  35.56,64.14 0 top
R10  87.63,46.35 180 top
R11  138.75,11.43 90 top
R12  123.19,19.05 180 bottom
R13  107.31,19.05 180 bottom
R14  91.44,19.05 180 bottom
R15  76.84,19.05 180 bottom
R16  62.23,19.05 180 bottom
R17  47.62,19.05 180 bottom
R18  40.64,33.02 90 bottom
R19  142.24,68.58 0 bottom
R20  17.78,68.58 180 bottom
R21  142.24,74.93 180 bottom
RN1  34.29,20.96 90 bottom
S1  130.81,8.89 90 bottom
S2  114.94,8.89 90 bottom
S3  99.06,8.89 90 bottom
S4  84.45,8.89 90 bottom
S5  69.85,8.89 90 bottom
S6  55.24,8.89 90 bottom
SW1  100.33,33.66 0 bottom
SW2  70.48,33.66 0 bottom
U1  102.87,46.35 180 top
U$1  [3,0]  3.81,84.45 0 bottom
U$2  [3,0]  31.75,84.45 0 bottom
U$3  [3,0]  143.51,84.45 0 bottom
U$4  [SARASWATI_LARGE]  1.27,40 0 top
U$5  [3,0]  3.81,3.17 0 bottom
U$6  [3,0]  31.75,3.17 0 bottom
U$7  [3,0]  143.51,3.17 0 bottom
U$8  29.21,46.35 90 bottom
U$9  96.52,68.58 0 bottom
X1  55.88,83.19 180 top
X2  76.2,83.19 180 top

### Tracks (layer width: path | path; a pad name or v marks a point on that pad's centre or on a via)
3.3V  (via drill 0.6)
  Top 0.406: IC7.14 34.29,57.78 25.4,48.89 v25.4,45.72 25.4,32.38 23.49,30.48 18.41,30.48 C14.1 C13.+ 9.27,29.46 IC4.3
  Bottom 0.254: U$8.4 30.07,45.72 v25.4,45.72
DAC_MOSI
  Top 0.254: IC2.17 128.27,51.43 128.91,52.07 131.44,52.07 132.08,51.43 132.08,48.89 136.53,44.45 139.06,44.45 140.97,42.54 140.97,35.56 139.06,33.66 IC3.4
DAC_OUT
  Top 0.305: IC3.8 144.15,41.27 143.51,41.91 143.51,44.45 142.88,45.08 139.7,45.08 138.43,46.35 138.43,51.43 139.06,52.07 JP4.1
DAC_SCK
  Top 0.254: IC2.18 130.81,48.89 136.21,43.5 138.75,43.5 140.02,42.23 140.02,37.78 138.43,36.2 IC3.3
DAC_SS  (via drill 0.6)
  Top 0.254: v129.54,57.15 128.91,56.52 92.07,56.52 v90.17,54.61 | v129.54,48.26 130.18,48.26 135.89,42.54 138.43,42.54 139.06,41.91 139.06,40 137.79,38.73 IC3.2
  Bottom 0.254: v129.54,57.15 v129.54,48.26 | IC2.2 v90.17,54.61
ENC1_A  (via drill 0.6)
  Top 0.254: v115.57,60.32 116.2,60.96 125.09,60.96 128.27,64.14 IC2.24 | v114.3,36.83 113.03,35.56 111.12,35.56 110.49,36.2 104.78,36.2 102.83,34.25 SW1.A
  Bottom 0.254: v114.3,36.83 114.3,59.05 v115.57,60.32
ENC1_B  (via drill 0.6)
  Top 0.254: v113.03,60.32 114.3,61.59 123.19,61.59 125.73,64.14 IC2.25 | v111.76,36.83 104.14,36.83 97.83,30.52 SW1.B
  Bottom 0.254: v111.76,36.83 111.76,59.05 v113.03,60.32
ENC1_CLICK  (via drill 0.6)
  Top 0.254: IC5.11 20.32,15.88 19.68,15.24 19.68,10.16 20.32,9.52 v36.83,9.52 | RN1.9 v36.83,31.12 43.18,37.46 97.16,37.46 v97.79,36.83
  Bottom 0.254: v36.83,9.52 37.46,10.16 37.46,27.3 36.83,27.94 v36.83,31.12 | SW1.E 97.79,40.61 v97.79,36.83
ENC2_A  (via drill 0.6)
  Top 0.254: v71.75,51.43 71.75,52.07 76.84,57.15 126.37,57.15 133.35,64.14 IC2.22 | v73.03,33.66 73.03,26.67 72.98,26.63 SW2.A
  Bottom 0.254: v73.03,33.66 73.03,34.29 71.12,36.2 71.12,50.8 v71.75,51.43
ENC2_B  (via drill 0.6)
  Top 0.254: v70.48,52.07 76.2,57.78 125.73,57.78 130.81,62.86 IC2.23 | v67.94,33.66 67.94,26.67 67.98,26.63 SW2.B
  Bottom 0.254: v67.94,33.66 70.48,36.2 v70.48,52.07
ENC2_CLICK  (via drill 0.6)
  Top 0.254: IC5.12 20.32,18.41 19.05,17.14 19.05,9.52 19.68,8.89 35.56,8.89 36.2,8.25 v38.1,8.25 | RN1.8 v38.1,28.57 46.35,36.83 67.31,36.83 v67.94,36.2
  Bottom 0.254: v38.1,8.25 v38.1,28.57 | SW2.E 67.98,36.87 67.94,36.83 v67.94,36.2
GND  (via drill 0.6)
  Top 0.254: v121.92,59.05 v124.46,59.05 | v128.27,53.97 v130.81,53.97 | v121.92,54.29 v118.11,54.29 v115.57,54.29 | v111.12,62.86 v114.94,62.86 | v69.22,44.45 v72.39,44.45 | v115.57,54.29 115.25,54.29 | v115.57,54.29 v113.03,54.29 v107.95,54.29 | v113.03,43.81 v118.75,43.81
  Bottom 0.305: IC3.5 146.05,33.66 146.69,34.29 146.69,48.89 146.05,49.53
  Bottom 1.778: 44.45,70.48 46.99,70.48
  pour Bottom (isolate 0.305, hatched): 146.05,74.3 135.89,84.45 49.53,84.45 46.99,81.91 46.99,64.14 41.91,59.05 5.08,59.05 2.54,56.52 2.54,17.14 19.05,0.63 135.89,0.63 146.05,10.79 146.05,30.48 140.97,35.56 140.97,40 146.05,43.81
  pour Bottom (isolate 0.305, hatched): 6.35,81.91 6.35,66.67 11.43,61.59 39.37,61.59 44.45,66.67 44.45,81.91 39.37,86.99 11.43,86.99
LCD_DATA4
  Top 0.254: IC2.36 97.79,64.14 97.16,63.5 92.07,63.5 91.44,64.14 91.44,69.22 100.58,78.36 U$9.11
LCD_DATA5
  Top 0.254: IC2.35 100.33,64.14 99.06,62.86 90.17,62.86 88.9,64.14 88.9,67.94 98.04,77.08 U$9.12
LCD_DATA6
  Top 0.254: IC2.34 102.87,64.14 100.97,62.23 88.27,62.23 86.36,64.14 86.36,66.67 95.5,75.81 U$9.13
LCD_DATA7
  Top 0.254: IC2.33 105.41,64.14 102.87,61.59 87.63,61.59 85.72,63.5 85.72,67.31 92.96,74.55 U$9.14
LCD_ENABLE
  Top 0.254: IC2.38 92.71,66.67 106.04,80.01 111.76,80.01 113.28,81.53 U$9.6
LCD_RS
  Top 0.254: IC2.37 95.25,67.94 106.68,79.38 116.2,79.38 118.36,81.53 U$9.4
MIDI_IN  (via drill 0.6)
  Top 0.254: OK1.6 69.85,64.14 R5.1 | IC2.14 120.65,51.43 119.38,52.7 78.1,52.7 v76.2,54.61
  Bottom 0.254: R5.1 76.2,57.78 v76.2,54.61
MIDI_OUT  (via drill 0.6)
  Top 0.254: IC2.15 123.19,51.43 121.28,53.34 82.55,53.34 v80.01,55.88
  Bottom 0.254: v80.01,55.88 R8.1
N$1  (via drill 0.6)
  Top 0.254: R16.1 62.86,23.5 120.01,23.5 v120.65,24.13
  Bottom 0.254: v120.65,24.13 122.56,26.04 122.56,34.29 123.19,34.92 127.63,34.92 131.44,38.73 IC6.2
N$2  (via drill 0.6)
  Top 0.254: v67.31,8.89 66.67,9.52 45.08,9.52 38.73,15.88 RN1.3 33.02,15.88 30.48,18.41 IC5.5
  Bottom 0.254: S5.3 67.36,3.12 67.31,3.17 v67.31,8.89 67.31,15.09 S5.4
N$3
  Top 0.254: IC6.9 127,23.5 128.27,24.77 134.62,24.77 135.89,23.5 JP2.3
N$4
  Top 0.305: R2.1 40.64,75.56 38.1,75.56 36.83,76.83 IC1.1 IC1.2
N$5
  Top 0.305: C2.- 7.62,76.83 R1.2
  Bottom 0.305: IC1.3 29.21,74.3 R1.2
N$6  (via drill 0.6)
  Top 0.254: v128.32,12.07 47.62,12.07 39.37,20.32 v39.37,26.04 RN1.7 | IC5.13 20.32,20.96 18.41,19.05 18.41,8.89 19.05,8.25 34.92,8.25 36.2,6.98 v39.37,6.98
  Bottom 0.254: S1.3 128.32,3.12 128.27,3.17 128.27,12.01 v128.32,12.07 128.27,12.12 128.27,14.61 128.32,14.66 S1.4 | v39.37,6.98 39.37,8.89 38.73,9.52 38.73,25.4 v39.37,26.04
N$7
  Top 0.254: IC2.32 C3.1
N$8
  Top 0.254: X2.5 80.01,71.75 R8.2
N$10  (via drill 0.6)
  Top 0.254: v52.7,8.25 52.07,8.89 44.45,8.89 40,13.34 RN1.2 33.02,13.34 30.48,15.88 IC5.6
  Bottom 0.254: S6.3 52.76,3.12 52.7,3.17 v52.7,8.25 52.7,15.09 S6.4
N$11
  Top 0.254: IC3.6 146.05,36.2 146.69,35.56 146.69,10.16 144.15,7.62 R11.1
N$12  (via drill 0.6)
  Top 0.254: v81.91,9.52 81.28,10.16 45.72,10.16 37.46,18.41 RN1.4 33.02,18.41 30.48,20.96 IC5.4
  Bottom 0.254: S4.3 81.97,3.12 81.91,3.17 v81.91,9.52 81.91,15.09 S4.4
N$13
  Top 0.254: OK1.7 67.31,67.94 76.2,67.94 R7.2
N$15
  Top 0.305: C2.+ 7.62,79.38 20.32,79.38 24.13,83.19 J1.T
N$16  (via drill 0.6)
  Top 0.254: v112.4,10.79 111.76,11.43 46.99,11.43 34.92,23.5 RN1.6 33.02,23.5 31.75,24.77 24.13,24.77 22.86,23.5 IC5.14
  Bottom 0.254: S2.3 112.45,3.12 112.4,3.17 v112.4,10.79 112.4,15.09 S2.4
N$17
  Top 0.305: R2.2 IC1.6 38.1,71.75 36.83,70.48 28.57,70.48 27.94,69.85 27.94,66.67 20.95,59.69 16.51,59.69 15.28,60.92 R20.P$1
N$18  (via drill 0.6)
  Top 0.254: v135.89,85.72 144.78,76.83
  Top 0.305: 144.78,76.83 R21.2
  Bottom 0.254: v135.89,85.72 121.28,85.72 120.65,85.09 120.65,83.19 120.9,82.94 U$9.3
N$25
  Bottom 0.254: U$8.2 30.15,50.8 33.02,50.8 33.66,50.16 IC7.11
N$28
  Top 0.254: R4.2 53.34,69.22 D1.C 55.88,66.67 OK1.2
N$29
  Bottom 0.254: U$8.5 30.18,43.18 33.66,43.18 34.29,43.81 36.83,43.81 38.1,45.08 IC7.6
N$30  (via drill 0.6)
  Top 0.254: v118.11,25.4 117.47,24.77 45.08,24.77 R18.1
  Bottom 0.254: v118.11,25.4 121.28,28.57 121.28,35.56 124.46,38.73 IC6.15
N$31  (via drill 0.6)
  Top 0.254: R17.1 48.89,24.13 118.75,24.13 v119.38,24.77
  Bottom 0.254: v119.38,24.77 121.92,27.3 121.92,34.92 124.46,37.46 128.27,37.46 132.08,41.27 IC6.1
N$33  (via drill 0.6)
  Top 0.254: R15.1 76.84,22.86 122.56,22.86 v123.19,23.5
  Bottom 0.254: v123.19,23.5 124.46,24.77 128.27,24.77 129.54,26.04 129.54,33.02 132.72,36.2 IC6.3
N$34  (via drill 0.6)
  Top 0.254: R14.1 90.81,22.23 127,22.23 v128.27,23.5
  Bottom 0.254: v128.27,23.5 130.18,25.4 130.18,31.75 132.08,33.66 IC6.4
N$35  (via drill 0.6)
  Top 0.254: R13.1 106.04,21.59 128.27,21.59 v129.54,22.86
  Bottom 0.254: v129.54,22.86 130.81,24.13 130.81,29.85 132.08,31.12 IC6.5
N$36  (via drill 0.6)
  Top 0.254: LED1.K LED2.K LED3.K LED4.K LED5.K LED6.K 43.18,17.78 40.64,20.32 v40.64,23.5
  Bottom 0.254: LED1.K 132.08,17.78 135.25,20.96 135.25,25.4 134.62,26.04 IC6.7 | v40.64,23.5 40.64,26.67 39.37,27.94 39.37,29.21 38.1,30.48 38.1,31.75 36.83,33.02 LED7.K
N$37  (via drill 0.6)
  Top 0.254: R12.1 121.28,20.96 129.54,20.96 v130.81,22.23
  Bottom 0.254: v130.81,22.23 131.44,22.86 131.44,27.94 132.08,28.57 IC6.6
N$42
  Top 0.254: LED7.A R18.2
N$43
  Top 0.254: R17.2 52.7,19.05 53.97,20.32 LED6.A
N$44
  Top 0.254: LED5.A 68.58,20.32 67.31,19.05 R16.2
N$45
  Top 0.254: R15.2 81.91,19.05 83.19,20.32 LED4.A
N$46
  Top 0.254: R14.2 96.52,19.05 97.79,20.32 LED3.A
N$47
  Top 0.254: R13.2 112.4,19.05 113.66,20.32 LED2.A
N$48
  Top 0.254: R12.2 128.27,19.05 129.54,20.32 LED1.A
N$52
  Bottom 0.254: U$8.1 30.19,53.34 33.66,53.34 34.29,53.97 36.83,53.97 38.1,52.7 IC7.3
N$68
  Top 0.254: X2.4 67.94,73.02 64.13,69.22 64.13,66.67 65.41,65.41 72.39,65.41 74.93,62.86 R6.1
N$72
  Top 0.254: X1.4 50.8,62.86 R4.1
N$73
  Top 0.254: D1.A 55.88,64.14 OK1.3 59.69,65.41 59.69,71.75 X1.5
N$79  (via drill 0.6)
  Top 0.61: U$9.15 92.06,84.45 v121.92,84.45 | v133.35,84.45 138.43,79.38 R19.2
  Bottom 0.61: v121.92,84.45 v133.35,84.45
N$82
  Top 0.254: IC2.13 118.11,47.62 120.52,45.21 Q1.1 124.46,45.08 C11.2
N$83
  Top 0.254: C10.2 111.76,45.08 Q1.2 115.7,45.59 115.57,45.72 IC2.12
N$90  (via drill 0.6)
  Top 0.254: v96.52,10.16 95.88,10.79 46.35,10.79 36.2,20.96 RN1.5 33.02,20.96 30.48,23.5 IC5.3
  Bottom 0.254: S3.3 96.57,3.12 96.52,3.17 v96.52,10.16 96.52,15.09 S3.4
PWM_CV1  (via drill 0.6)
  Top 0.254: v95.25,54.61 96.52,55.88 130.18,55.88 139.06,64.77 JP4.6
  Bottom 0.254: IC2.4 v95.25,54.61
PWM_CV2  (via drill 0.6)
  Top 0.254: v97.79,54.61 98.42,55.24 130.81,55.24 137.79,62.23 JP4.5
  Bottom 0.254: IC2.5 v97.79,54.61
PWM_Q
  Top 0.254: IC2.21 135.89,66.67 136.53,67.31 140.97,67.31 142.24,66.04 142.24,60.32 141.6,59.69 JP4.4
PWM_VCA
  Top 0.254: IC2.19 133.35,48.89 133.98,48.26 136.53,48.26 137.16,48.89 137.16,52.07 139.7,54.61 JP4.2
PWM_VCF
  Top 0.254: JP4.3 139.06,57.15 135.89,53.97 IC2.20
RESET
  Top 0.254: U1.5 C8.1 R10.1
  Bottom 0.254: IC2.9 107.95,48.89 106.68,47.62 99.06,47.62 U1.5
SAMPLE_IN  (via drill 0.6)
  Top 0.305: v87.63,71.75 87.63,75.56 83.82,79.38 48.26,79.38 43.18,74.3 IC1.7 38.1,74.3 36.83,73.02 22.86,73.02 20.32,70.48 20.32,61.92 R20.P$3 R20.P$2
  Bottom 0.305: v87.63,71.75 IC2.40
SD_MISO  (via drill 0.6)
  Top 0.254: IC2.7 U1.1 105.41,43.81 105.41,40.64 104.14,39.37 87,39.37 80.01,46.35 50.16,46.35 45.08,41.27 36.2,41.27 v33.02,38.1
  Bottom 0.254: U$8.7 30.26,38.1 v33.02,38.1
SD_MOSI
  Top 0.254: IC2.6 100.33,48.89 99.06,47.62 | 99.06,47.62 99.06,45.08 U1.4 | IC7.12 36.83,52.7 40.64,48.89 81.28,48.89 82.55,47.62 99.06,47.62
SD_SCK
  Top 0.254: IC7.5 80.64,47.62 85.72,42.54 100.97,42.54 101.6,43.18 101.6,46.35 | IC2.8 105.41,51.43 104.78,52.07 102.23,52.07 101.6,51.43 101.6,46.35 | 101.6,46.35 U1.3
SD_SS
  Top 0.254: IC2.1 87.63,49.53 86.36,48.26 83.19,48.26 81.91,49.53 50.16,49.53 44.45,55.24 IC7.2
SOFT_EN  (via drill 0.6)
  Top 0.254: IC5.1 29.21,32.38 35.56,38.73 115.57,38.73 123.19,31.12 IC6.12 127,31.12 128.27,32.38 | 128.27,32.38 v128.27,40 | 128.27,32.38 135.25,32.38 139.06,28.57 JP2.1
  Bottom 0.254: IC2.26 123.19,55.88 127,52.07 127,48.89 128.27,47.62 v128.27,40
SOFT_MISO  (via drill 0.6)
  Top 0.254: v24.13,33.02 24.13,50.16 33.02,59.05 v118.11,59.05
  Bottom 0.254: v24.13,33.02 24.13,12.07 22.86,10.79 IC5.9 | IC2.28 118.11,64.14 117.47,63.5 117.47,59.69 v118.11,59.05
SOFT_MOSI  (via drill 0.6)
  Top 0.254: IC6.14 v123.19,38.73
  Bottom 0.254: IC2.27 120.65,52.7 121.92,51.43 121.92,48.89 123.19,47.62 v123.19,38.73
SOFT_SCK  (via drill 0.6)
  Top 0.254: IC5.2 30.48,26.04 31.75,27.3 31.75,33.66 36.2,38.1 114.94,38.1 117.47,35.56 | 117.47,35.56 124.46,28.57 IC6.11 127,28.57 128.27,29.85 135.25,29.85 139.06,26.04 JP2.2 | 117.47,35.56 v117.47,34.29
  Bottom 0.254: IC2.29 115.57,64.14 116.84,62.86 116.84,48.89 117.47,48.26 v117.47,34.29
VCC  (via drill 0.6)
  Top 0.254: OK1.8 C5.1 R5.2 R6.2 | v95.88,45.08 85.09,45.08 R10.2 | IC6.10 127,26.04 128.27,27.3 v135.89,27.3
  Top 0.305: R9.1 C6.1
  Top 0.406: v45.72,79.38 C1.1 IC1.8 | IC3.1 135.89,41.27 134.62,42.54 125.73,42.54 | IC4.2 6.35,27.3 10.16,23.5 C16.1 | C16.1 17.78,22.23 23.49,22.23 25.4,20.32 25.4,13.97 27.3,12.07 31.75,12.07 33.02,10.79 RN1.1 | C16.1 17.78,24.77 17.78,27.3 19.05,28.57 IC5.16 | 35.56,60.32 R9.1 | 125.73,42.54 124.46,42.54 123.19,41.27 C17.1 | 125.73,42.54 IC6.16
  Top 0.61: IC4.2 2.54,27.3 1.27,28.57 1.27,33.66 27.94,60.32 35.56,60.32 40.64,60.32 45.72,65.41 v45.72,73.02
  Top 0.813: IC2.10 110.49,48.89 C9.1 | IC2.30 C4.1 113.03,70.48 123.19,80.64 123.19,82.56 U$9.2 123.44,82.94 123.19,83.19 123.19,85.72 | 123.19,85.72 133.98,85.72 R21.1 142.24,74.93 146.05,71.12 R19.1 146.05,50.8 v142.24,46.99 JP3.2 | 123.19,85.72 87.63,85.72 83.82,81.91 v73.66,81.91 48.26,81.91 v45.72,79.38 | C12.1 v142.24,41.27 v142.24,27.3 142.24,18.41 | 142.24,18.41 144.78,15.88 144.78,15.24 | 144.78,15.24 C15.+ | 142.24,18.41 JP1.2 | 144.78,15.24 R11.2
  Bottom 0.254: U1.2 101.6,45.08 v95.88,45.08 | v142.24,27.3 v135.89,27.3
  Bottom 0.406: v142.24,41.27 IC3.1 | v73.66,81.91 73.66,70.48 R5.2
  Bottom 0.813: IC2.10 110.49,60.01 113.03,62.55 IC2.30 | C9.1 105.41,43.81 U1.2 | v45.72,73.02 v45.72,79.38 | v142.24,46.99 C12.1
VCC/2
  Top 0.305: 29.21,67.94 R1.1 | 29.21,67.94 39.37,67.94 | 39.37,67.94 IC1.5 | C6.2 29.21,67.94 | 39.37,67.94 R3.1 R9.2 C7.1

### Text on the board
bPlace: CV1< | CV2< | Q< | F< | VCA< | SMP< | GND | +5V | TX< | EN< | CLK< | Q7'< | GND | +5V
tNames: Out | In | Shruthi-612 v0.1 | Mutable Instruments
bNames: 100kA | Output expansion